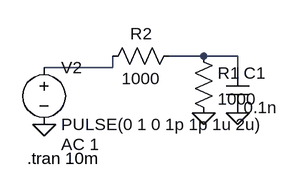
[diagram p0: schematic Draft1.asc]
Draft1.asc, the LTspice schematic file:
Version 4
SHEET 1 884 680
WIRE 640 48 592 48
WIRE 688 48 640 48
WIRE 512 64 512 48
WIRE 512 64 416 64
WIRE 688 64 688 48
FLAG 688 128 0
FLAG 416 144 0
FLAG 640 128 0
SYMBOL voltage 416 48 R0
WINDOW 123 24 124 Left 2
WINDOW 39 0 0 Left 0
SYMATTR Value2 AC 1
SYMATTR InstName V2
SYMATTR Value PULSE(0 1 0 1p 1p 1u 2u)
SYMBOL cap 672 64 R0
SYMATTR InstName C1
SYMATTR Value 0.1n
SYMBOL res 608 32 R90
WINDOW 0 0 56 VBottom 2
WINDOW 3 32 56 VTop 2
SYMATTR InstName R2
SYMATTR Value 1000
SYMBOL res 624 32 R0
SYMATTR InstName R1
SYMATTR Value 1000
TEXT 392 192 Left 2 !.tran 10m

The netlist it stands for:
* Draft1.asc
V2 N002 0 PULSE(0 1 0 1p 1p 1u 2u) AC 1
C1 N001 0 0.1n
R2 N001 N002 1000
R1 N001 0 1000
.tran 10m
.backanno
.end